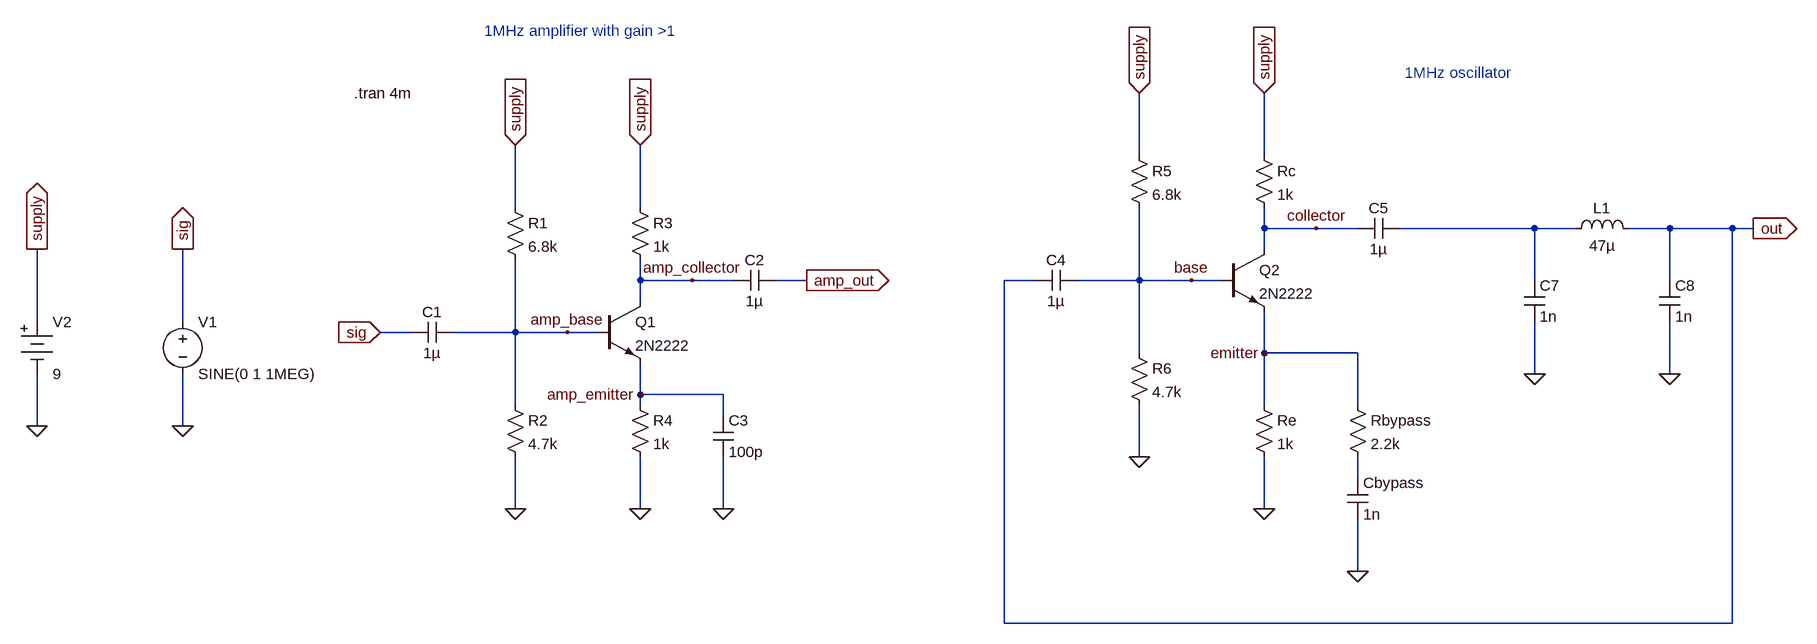
[diagram p0: schematic 1mhz-colpitts-oscillator-bjt.asc]
1mhz-colpitts-oscillator-bjt.asc, the LTspice schematic file:
Version 4
SHEET 1 2048 680
WIRE 1008 -64 1008 -160
WIRE 1200 -64 1200 -160
WIRE 48 16 48 -80
WIRE 240 16 240 -80
WIRE 1200 48 1200 16
WIRE 1280 48 1200 48
WIRE 1344 48 1280 48
WIRE 1616 48 1408 48
WIRE 1680 48 1616 48
WIRE 1824 48 1760 48
WIRE 1920 48 1824 48
WIRE 1952 48 1920 48
WIRE 1200 80 1200 48
WIRE 240 128 240 96
WIRE 320 128 240 128
WIRE 384 128 320 128
WIRE 496 128 448 128
WIRE 848 128 800 128
WIRE 1008 128 1008 16
WIRE 1008 128 912 128
WIRE 1088 128 1008 128
WIRE 1136 128 1088 128
WIRE 1616 128 1616 48
WIRE 1824 128 1824 48
WIRE 240 160 240 128
WIRE -688 192 -688 80
WIRE -464 192 -464 80
WIRE -112 208 -160 208
WIRE 48 208 48 96
WIRE 48 208 -48 208
WIRE 128 208 48 208
WIRE 176 208 128 208
WIRE 1008 240 1008 128
WIRE 1200 240 1200 176
WIRE 1344 240 1200 240
WIRE 1616 272 1616 192
WIRE 1824 272 1824 192
WIRE 240 304 240 256
WIRE 368 304 240 304
WIRE 48 320 48 208
WIRE 240 320 240 304
WIRE 1200 320 1200 240
WIRE 1344 320 1344 240
WIRE 368 336 368 304
WIRE -688 352 -688 272
WIRE -464 352 -464 272
WIRE 1008 400 1008 320
WIRE 1344 432 1344 400
WIRE 48 480 48 400
WIRE 240 480 240 400
WIRE 368 480 368 400
WIRE 1200 480 1200 400
WIRE 1344 576 1344 496
WIRE 800 656 800 128
WIRE 1920 656 1920 48
WIRE 1920 656 800 656
FLAG -688 352 0
FLAG -688 80 supply
IOPIN -688 80 Out
FLAG 48 -80 supply
IOPIN 48 -80 In
FLAG 48 480 0
FLAG 240 480 0
FLAG 240 -80 supply
IOPIN 240 -80 In
FLAG -464 352 0
FLAG -464 80 sig
IOPIN -464 80 Out
FLAG -160 208 sig
IOPIN -160 208 In
FLAG 496 128 amp_out
IOPIN 496 128 Out
FLAG 128 208 amp_base
FLAG 320 128 amp_collector
FLAG 240 304 amp_emitter
FLAG 368 480 0
FLAG 1008 -160 supply
IOPIN 1008 -160 In
FLAG 1008 400 0
FLAG 1200 480 0
FLAG 1200 -160 supply
IOPIN 1200 -160 In
FLAG 1088 128 base
FLAG 1280 48 collector
FLAG 1344 576 0
FLAG 1616 272 0
FLAG 1824 272 0
FLAG 1952 48 out
IOPIN 1952 48 Out
FLAG 1200 240 emitter
SYMBOL npn 176 160 R0
SYMATTR InstName Q1
SYMATTR Value 2N2222
SYMBOL voltage -464 176 R0
WINDOW 123 0 0 Left 0
WINDOW 39 0 0 Left 0
SYMATTR InstName V1
SYMATTR Value SINE(0 1 1MEG)
SYMBOL Misc\\battery -688 176 R0
WINDOW 123 0 0 Left 0
WINDOW 39 0 0 Left 0
SYMATTR InstName V2
SYMATTR Value 9
SYMBOL res 32 0 R0
SYMATTR InstName R1
SYMATTR Value 6.8k
SYMBOL res 32 304 R0
SYMATTR InstName R2
SYMATTR Value 4.7k
SYMBOL res 224 0 R0
SYMATTR InstName R3
SYMATTR Value 1k
SYMBOL res 224 304 R0
SYMATTR InstName R4
SYMATTR Value 1k
SYMBOL cap -48 192 R90
WINDOW 0 0 32 VBottom 2
WINDOW 3 32 32 VTop 2
SYMATTR InstName C1
SYMATTR Value 1µ
SYMBOL cap 448 112 R90
WINDOW 0 0 32 VBottom 2
WINDOW 3 32 32 VTop 2
SYMATTR InstName C2
SYMATTR Value 1µ
SYMBOL cap 352 336 R0
SYMATTR InstName C3
SYMATTR Value 100p
SYMBOL npn 1136 80 R0
SYMATTR InstName Q2
SYMATTR Value 2N2222
SYMBOL res 992 -80 R0
SYMATTR InstName R5
SYMATTR Value 6.8k
SYMBOL res 992 224 R0
SYMATTR InstName R6
SYMATTR Value 4.7k
SYMBOL res 1184 -80 R0
SYMATTR InstName Rc
SYMATTR Value 1k
SYMBOL res 1184 304 R0
SYMATTR InstName Re
SYMATTR Value 1k
SYMBOL cap 912 112 R90
WINDOW 0 0 32 VBottom 2
WINDOW 3 32 32 VTop 2
SYMATTR InstName C4
SYMATTR Value 1µ
SYMBOL cap 1408 32 R90
WINDOW 0 0 32 VBottom 2
WINDOW 3 32 32 VTop 2
SYMATTR InstName C5
SYMATTR Value 1µ
SYMBOL cap 1328 432 R0
SYMATTR InstName Cbypass
SYMATTR Value 1n
SYMBOL ind 1664 64 R270
WINDOW 0 32 56 VTop 2
WINDOW 3 5 56 VBottom 2
SYMATTR InstName L1
SYMATTR Value 47µ
SYMBOL cap 1600 128 R0
SYMATTR InstName C7
SYMATTR Value 1n
SYMBOL cap 1808 128 R0
SYMATTR InstName C8
SYMATTR Value 1n
SYMBOL res 1328 304 R0
SYMATTR InstName Rbypass
SYMATTR Value 2.2k
TEXT -200 -160 Left 2 !.tran 4m
TEXT 0 -256 Left 2 ;1MHz amplifier with gain >1
TEXT 1416 -192 Left 2 ;1MHz oscillator

The netlist it stands for:
* 1mhz-colpitts-oscillator-bjt.asc
Q1 amp_collector amp_base amp_emitter 0 2N2222
V1 sig 0 SINE(0 1 1MEG)
V2 supply 0 9
R1 supply amp_base 6.8k
R2 amp_base 0 4.7k
R3 supply amp_collector 1k
R4 amp_emitter 0 1k
C1 amp_base sig 1µ
C2 amp_out amp_collector 1µ
C3 amp_emitter 0 100p
Q2 collector base emitter 0 2N2222
R5 supply base 6.8k
R6 base 0 4.7k
Rc supply collector 1k
Re emitter 0 1k
C4 base out 1µ
C5 N001 collector 1µ
Cbypass N002 0 1n
L1 N001 out 47µ
C7 N001 0 1n
C8 out 0 1n
Rbypass emitter N002 2.2k
.model NPN NPN
.model PNP PNP
.lib standard.bjt
.tran 4m
* 1MHz amplifier with gain >1
* 1MHz oscillator
.backanno
.end